# Altium schematic sheet INDICATOR.SchDoc
size A4
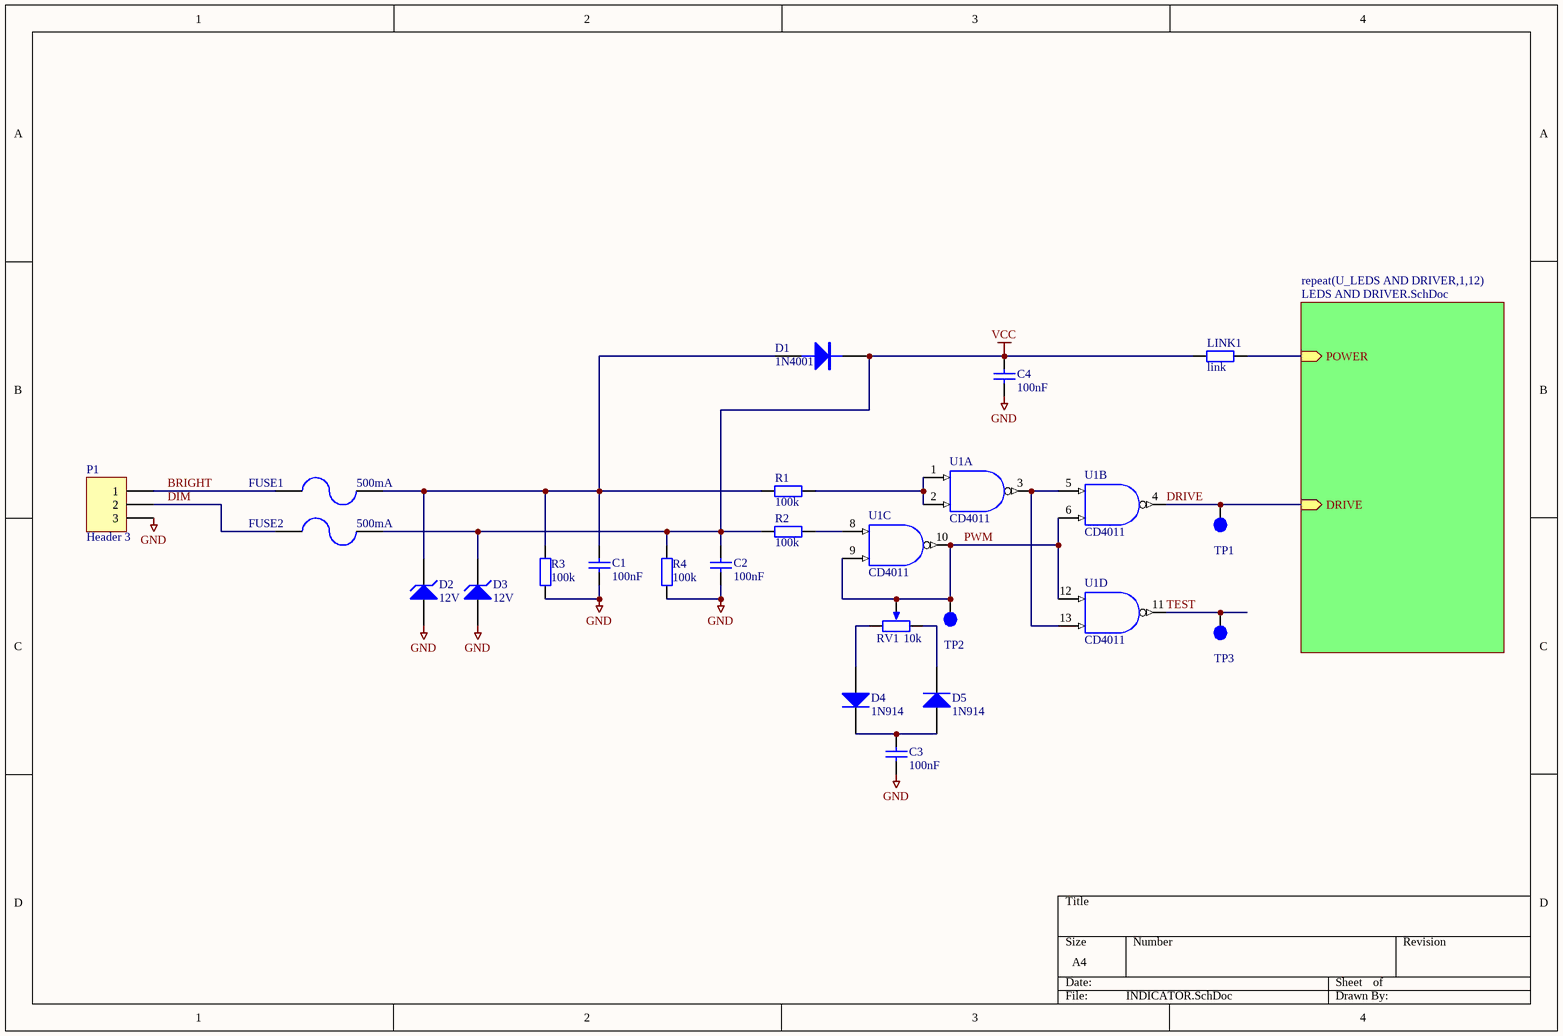
[diagram p0: INDICATOR.SchDoc]

## Parts
C1  100nF  [RAD-0.2-0.3]
C2  100nF  [RAD-0.2-0.3]
C3  100nF  [RAD-0.2-0.3]
C4  100nF  [RAD-0.2-0.3]
D1  1N4001  [1N4001]
D2  12V  [1N4001]
D3  12V  [1N4001]
D4  1N914  [DO-35A]
D5  1N914  [DO-35A]
FUSE1  500mA  [miniSMD Polyswitch]
FUSE2  500mA  [miniSMD Polyswitch]
LINK1  value link  [AXIAL-0.4]  (hidden comment: Res2)
P1  Header 3  [TAIL]
R1  value 100k  [AXIAL-0.4]  (hidden comment: Res2)
R2  value 100k  [AXIAL-0.4]  (hidden comment: Res2)
R3  value 100k  [AXIAL-0.4]  (hidden comment: Res2)
R4  value 100k  [AXIAL-0.4]  (hidden comment: Res2)
RV1  10k  [TRIMPOT (10 TURN)]
TP1  TestPoint  [TP_TH]  (value not drawn)
TP2  TestPoint  [TP_TH]  (value not drawn)
TP3  TestPoint  [TP_TH]  (value not drawn)
U1  CD4011  [DIP-14]  (parts A,B,C,D of 4)

## Sub-sheets
repeat(U_LEDS AND DRIVER,1,12) = LEDS AND DRIVER.SchDoc: POWER (in), DRIVE (in)

## Nets
GND: C1.1 C2.1 C3.1 C4.1 D2.2(A) D3.2(A) P1.3 R3.2 R4.2
VCC: C2.2 C4.2 D1.2(K) D3.1(K) FUSE2.2 LINK1.2 R2.2 R4.1 U1.7(VCC) U1.14(GND)
BRIGHT: FUSE1.1 P1.1
DIM: FUSE2.1 P1.2
DRIVE: TP1.1 U1.4(Y) ; sheet repeat(U_LEDS AND DRIVER,1,12)/DRIVE
PWM: RV1.2 TP2.1 U1.6(B) U1.9(B) U1.10(Y) U1.12(A)
TEST: TP3.1 U1.11(Y)
NetC1_2: C1.2 D1.1(A) D2.1(K) FUSE1.2 R1.2 R3.1
NetC3_2: C3.2 D4.2(K) D5.1(A)
NetD4_1: D4.1(A) RV1.1
NetD5_2: D5.2(K) RV1.3
NetLINK1_1: LINK1.1 ; sheet repeat(U_LEDS AND DRIVER,1,12)/POWER
NetR1_1: R1.1 U1.1(A) U1.2(B)
NetR2_1: R2.1 U1.8(A)
NetU1_3: U1.3(Y) U1.5(A) U1.13(B)

## Library data of the parts
C1-C4 = Cap: Capacitor; Value: 100nF; Supplier 1: Mouser; Supplier 2: Digi-Key; Supplier Part Number 1: 603-C0603ZRY5V9BB104; Supplier Part Number 2: 311-1343-2-ND
D1 = DIODE: DIODE, POWER; value: 1N4004
D2 D3 = D Zener: ZENER 12V 1W; pin to pad: 1>2 2>1
D4 D5 = Diode 1N914: High Conductance Fast Diode; Published: 8-Jun-2000; LatestRevisionDate: 17-Jul-2002; LatestRevisionNote: Re-released for DXP Platform.; DatasheetVersion: 1997; PackageReference: DO-35; Publisher: Altium Limited; PackageDescription: Diode, Axial; Body 3.8 x 1.9 mm (LxDia. max), Lead Dia. 0.53 mm (max); Code_JEDEC: DO-204-AH; ComponentLink1Description: Manufacturer Link; ComponentLink1URL: http://www.fairchildsemi.com/; ComponentLink2Description: Datasheet; ComponentLink2URL: http://www.fairchildsemi.com/ds/1N%2F1N4448.pdf
FUSE1 FUSE2 = POLYSWITCH 500mA: Manufacturer: Tyco Electronics / Raychem; Manufacturer Part No.: MINISMDC050F-2; Mouser Part no.: 650-MINISMDC050F-2; Farnell Part no.: 1175839; Web link: http://au.mouser.com/ProductDetail/Tyco-Electronics-Raychem/MINISMDC050F-2/?qs=sGAEpiMZZMu7EFbsM1w0neRfX3mrvYIvOpkrchiUGng%3d
LINK1 R1-R4 = Res2: Resistor
P1 = Header 3: Header, 3-Pin; LatestRevisionDate: 17-Jul-2002; LatestRevisionNote: Re-released for DXP Platform.; Publisher: Altium Limited
RV1 = VAR (POT) SMD: Variable Resistor; Manufacturer: Bourns; Manufacturer Part No.: CR0603FX-1002ELF; Value: 10k; Mouser Part no.: 652-CR0603FX-1002ELF; Web link: http://au.mouser.com/Search/Refine.aspx?Keyword=652-CR0603FX-1002ELF
U1 = CD4011: Quadruple 2-Input Positive-NAND Gate